# Altium project Pet_Feeder_Board.PrjPcb (part 2 of 3)

## Sheet BG_PWR_Radio_Schematic.SchDoc
size A; SheetNumber: 3; SheetTotal: 6
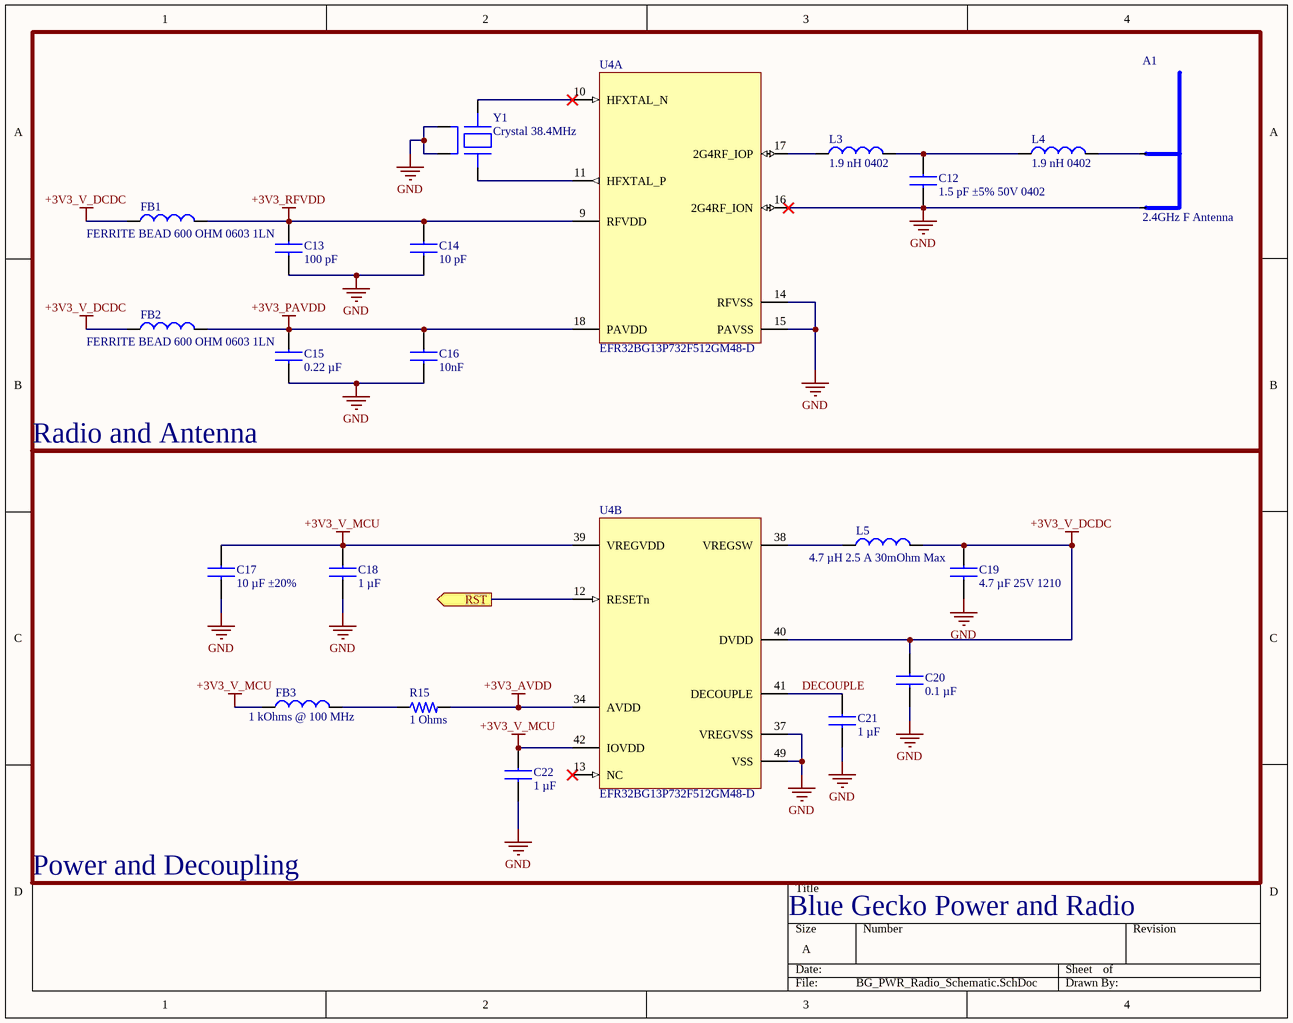
[diagram p2: BG_PWR_Radio_Schematic.SchDoc]

### Parts
A1  2.4GHz F Antenna  [F_ANT]  (net tie, no BOM)
C12  1.5 pF ±5% 50V 0402  [CAPC0402X06N]
C13  100 pF  [CAPC0603X09N]
C14  10 pF  [CAPC0603X09N]
C15  0.22 µF  [CAPC0603X10N-Y]
C16  10nF  [CAPC0603X09N]
C17  10 µF ±20%  [CAPC0603X10N-M]
C18  1 µF  [CAPC0603X10N]
C19  4.7 µF 25V 1210  [CAPC1210X17N]
C20  0.1 µF  [CAPC0603X09N]
C21  1 µF  [CAPC0603X10N]
C22  1 µF  [CAPC0603X10N]
FB1  FERRITE BEAD 600 OHM 0603 1LN  [BLM18AG601SN1D]
FB2  FERRITE BEAD 600 OHM 0603 1LN  [BLM18AG601SN1D]
FB3  1 kOhms @ 100 MHz  [INDC0603X10N]
L3  1.9 nH 0402  [INDC0402X04N]
L4  1.9 nH 0402  [INDC0402X04N]
L5  4.7 µH 2.5 A 30mOhm Max  [INDP7272X45N]
R15  1 Ohms  [RESC0603X05N]
U4  EFR32BG13P732F512GM48-D  [48-QFN_7x7]  (parts A,B of 3)
Y1  Crystal 38.4MHz  [DFN105P160X40-4N]

### Blocks framed on the sheet
Radio and Antenna: A1 C12-C16 FB1 FB2 L3 L4 U4 Y1
Power and Decoupling: C17-C22 FB3 L5 R15 U4

### Ports
RST (out)

### Nets
+3V3_AVDD: R15.2 U4.34(AVDD)
+3V3_PAVDD: C15.1 C16.1 FB2.2 U4.18(PAVDD)
+3V3_RFVDD: C13.1 C14.1 FB1.2 U4.9(RFVDD)
+3V3_V_DCDC: C19.1 C20.1 FB1.1 FB2.1 L5.2 U4.40(DVDD)
+3V3_V_MCU: C17.1 C18.1 C22.1 FB3.1 U4.39(VREGVDD) U4.42(IOVDD)
GND: A1.GND C12.2 C13.2 C14.2 C15.2 C16.2 C17.2 C18.2 C19.2 C20.2 C21.2 C22.2 U4.14(RFVSS) U4.15(PAVSS) U4.16(2G4RF_ION) U4.37(VREGVSS) U4.49(VSS) Y1.2(GND) Y1.4(GND)
DECOUPLE: C21.1 U4.41(DECOUPLE)
RST: U4.12(RESETn) ; port RST
NetA1_FEED: A1.FEED L4.2
NetC12_1: C12.1 L3.2 L4.1
NetFB3_2: FB3.2 R15.1
NetL3_1: L3.1 U4.17(2G4RF_IOP)
NetL5_1: L5.1 U4.38(VREGSW)
NetU4_10: U4.10(HFXTAL_N) Y1.1(OSC_1)
NetU4_11: U4.11(HFXTAL_P) Y1.3(OSC_2)

Not connected (* = marked no-connect by the designer): U4 13(NC)*

### Notes on the sheet
- Blue Gecko Power and Radio

### Library data of the parts
A1 = F_ANT
C12 = GCM1555C1H1R5JA16D: Cap Ceramic 1.5pF 50V C0G 5% Pad SMD 0402 125C Automotive T/R; Manufacturer: Murata; Supplier 1: Digi-Key; Manufacturer Part Number: GCM1555C1H1R5JA16D; RoHS: Yes; Category: Ceramic Capacitors; Stock 1: 4046; Pricing 1: 1=0.10000, 10=0.04700, 50=0.02580, 100=0.02100, 500=0.01502, 1000=0.01180, 2500=0.01072, 5000=0.00987 (USD); Mount: Surface Mount; Case/Package: 0402; Case Code (Imperial): 0402; Case Code (Metric): 1005; Min Operating Temperature: -55°C; Max Operating Temperature: 125°C; Packaging: Cut Tape; Capacitance: 1.5pF; Tolerance: 5%; Voltage Rating: 50V; Ratings: AEC-Q200; ComponentLink1URL: http://search.murata.co.jp/Ceramy/image/img/A01X/G101/ENG/GCM1555C1H1R5JA16-01.pdf?src-supplier=Digi-Key; ComponentLink1Description: http://search.murata.co.jp/Ceramy/image/img/A01X/G101/ENG/GCM1555C1H1R5JA16-01.pdf?src-supplier=Digi-Key
C13 = C0603C101J4GAC7867: Cap Ceramic 100pF 16V C0G 5% SMD 0603 125°C Paper T/R; Manufacturer: KEMET; Supplier 1: Digi-Key; Manufacturer Part Number: C0603C101J4GAC7867; RoHS: Yes; Category: Ceramic Capacitors; Stock 1: 12069; Pricing 1: 1=0.25000, 10=0.17400, 50=0.11580, 100=0.09840, 500=0.06944, 1000=0.06075 (USD); Mount: Surface Mount; Case/Package: 0603; Dielectric Material: Ceramic; Min Operating Temperature: -55°C; Max Operating Temperature: 125°C; Capacitance: 100pF; Tolerance: 5%; Dielectric: C0G; Packaging: Tape and Reel; Voltage Rating (DC): 16V; Construction: Flat; Length: 1.6mm; Height: 0.8mm; Depth: 0.8mm; Radiation Hardening: No; Lead Free: Lead Free; ComponentLink1URL: http://components.arrow.com/part/dataview/0323_00312687?src-supplier=Arrow+Europe; ComponentLink1Description: http://components.arrow.com/part/dataview/0323_00312687?src-supplier=Arrow+Europe; ComponentLink2URL: http://capacitoredge.kemet.com/capedge2/DataSheet?pn=C0603C101J4GAC7867&src-supplier=Avnet+Europe; ComponentLink2Description: http://capacitoredge.kemet.com/capedge2/DataSheet?pn=C0603C101J4GAC7867&src-supplier=Avnet+Europe; ComponentLink3URL: https://api.kemet.com/component-edge/download/datasheet/C0603C101J4GACTU.pdf?src-supplier=Digi-Key; ComponentLink3Description: https://api.kemet.com/component-edge/download/datasheet/C0603C101J4GACTU.pdf?src-supplier=Digi-Key; ComponentLink4URL: https://search.kemet.com/component-edge/download/datasheet/C0603C101J4GACTU.pdf?src-supplier=Digi-Key; ComponentLink4Description: https://search.kemet.com/component-edge/download/datasheet/C0603C101J4GACTU.pdf?src-supplier=Digi-Key; ComponentLink5URL: http://capacitoredge.kemet.com/capedge2/DataSheet?pn=C0603C101J4GAC7867&src-supplier=Avnet; ComponentLink5Description: http://capacitoredge.kemet.com/capedge2/DataSheet?pn=C0603C101J4GAC7867&src-supplier=Avnet
C14 = C0603C100J4GAC7867: Cap Ceramic 10pF 16V C0G 5% SMD 0603 125°C Paper T/R; Manufacturer: KEMET; Supplier 1: Digi-Key; Manufacturer Part Number: C0603C100J4GAC7867; RoHS: Yes; Category: Ceramic Capacitors; Stock 1: 29408; Pricing 1: 1=0.25000, 10=0.17400, 50=0.11580, 100=0.09840, 500=0.06944, 1000=0.06075 (USD); Mount: Surface Mount; Case/Package: 0603; Dielectric Material: Ceramic; Min Operating Temperature: -55°C; Max Operating Temperature: 125°C; Capacitance: 10pF; Tolerance: 5%; Dielectric: C0G; Packaging: Tape and Reel; Voltage Rating (DC): 16V; Construction: Flat; Length: 1.6mm; Height: 0.8mm; Depth: 0.8mm; Radiation Hardening: No; Lead Free: Lead Free; ComponentLink1URL: http://components.arrow.com/part/dataview/0323_00312750?src-supplier=Arrow+Europe; ComponentLink1Description: http://components.arrow.com/part/dataview/0323_00312750?src-supplier=Arrow+Europe; ComponentLink2URL: http://capacitoredge.kemet.com/capedge2/DataSheet?pn=C0603C100J4GAC7867&src-supplier=Avnet+Europe; ComponentLink2Description: http://capacitoredge.kemet.com/capedge2/DataSheet?pn=C0603C100J4GAC7867&src-supplier=Avnet+Europe; ComponentLink3URL: https://api.kemet.com/component-edge/download/datasheet/C0603C100J4GACTU.pdf?src-supplier=Digi-Key; ComponentLink3Description: https://api.kemet.com/component-edge/download/datasheet/C0603C100J4GACTU.pdf?src-supplier=Digi-Key; ComponentLink4URL: http://capacitoredge.kemet.com/capedge2/DataSheet?pn=C0603C100J4GAC7867&src-supplier=Avnet; ComponentLink4Description: http://capacitoredge.kemet.com/capedge2/DataSheet?pn=C0603C100J4GAC7867&src-supplier=Avnet
C15 = CC0603JRX7R7BB224: 0603 0.22 uF 16 V ±5% Tolerance X7R Multilayer Ceramic Capacitor; Manufacturer: Yageo; Capacitance: 220nF; Voltage Rating (DC): 16V; Supplier 1: Digi-Key; Manufacturer Part Number: CC0603JRX7R7BB224; RoHS: Yes; Category: Ceramic Capacitors; Stock 1: 48553; Pricing 1: 1=0.14000, 10=0.09800, 50=0.05580, 100=0.04620, 500=0.03238, 1000=0.02680 (USD); Mount: Surface Mount; Case/Package: 0603; Case Code (Imperial): 0603; Case Code (Metric): 1608; Weight: 7.1E-05oz; Min Operating Temperature: -55°C; Max Operating Temperature: 125°C; Tolerance: 5%; Packaging: Tape and Reel; Dielectric: X7R; Voltage Rating: 16V; Termination: SMD/SMT; Resistor Type: Ceramic; Series: CC; Length: 0.063inch; Width: 0.031inch; Thickness: 0.035inch; Depth: 0.8mm; Lead Free: Lead Free; Halogen Free: Halogen Free; RoHS Compliant: Yes; ComponentLink1URL: http://www.mouser.com/ds/2/447/Yageo_UPY-GP_NP0_16V-to-50V_9-358835.pdf?src-supplier=Mouser; ComponentLink1Description: http://www.mouser.com/ds/2/447/Yageo_UPY-GP_NP0_16V-to-50V_9-358835.pdf?src-supplier=Mouser; ComponentLink2URL: http://components.arrow.com/part/dataview/0323_04166475?src-supplier=Arrow+Europe; ComponentLink2Description: http://components.arrow.com/part/dataview/0323_04166475?src-supplier=Arrow+Europe; ComponentLink3URL: http://www.yageo.com/exep/pages/download/literatures/ProductSelectionGuide%202014_Final_2.pdf?src-supplier=Digi-Key; ComponentLink3Description: http://www.yageo.com/exep/pages/download/literatures/ProductSelectionGuide%202014_Final_2.pdf?src-supplier=Digi-Key; ComponentLink4URL: http://www.yageo.com/documents/recent/UPY-GPHC_X7R_6.3V-to-50V_18.pdf?src-supplier=Digi-Key; ComponentLink4Description: http://www.yageo.com/documents/recent/UPY-GPHC_X7R_6.3V-to-50V_18.pdf?src-supplier=Digi-Key
C16 = C0603C103J4RACTU: Cap Ceramic 0.01uF 16V X7R 5% SMD 0603 125°C Paper T/R; Manufacturer: KEMET; Dissipation Factor: 3.5%; Supplier 1: Digi-Key; Manufacturer Part Number: C0603C103J4RACTU; RoHS: Yes; Category: Ceramic Capacitors; Stock 1: 5301; Pricing 1: 1=0.35000, 10=0.24300, 50=0.16200, 100=0.13760, 500=0.09716, 1000=0.08501 (USD); Mount: Surface Mount; Case/Package: 0603; Case Code (Metric): 1608; Case Code (Imperial): 0603; Dielectric Material: Ceramic; Min Operating Temperature: -55°C; Max Operating Temperature: 125°C; Tolerance: 5%; Capacitance: 10nF; Dielectric: X7R; Packaging: Tape and Reel; Voltage Rating: 16V; Package Quantity: 1; Voltage Rating (DC): 16V; Termination: SMD/SMT; Series: C; Construction: Flat; Length: 1.6mm; Width: 0.031inch; Height: 0.8mm; Thickness: 0.034inch; Lead Pitch: 0.7mm; Depth: 0.8mm; Radiation Hardening: No; REACH SVHC: No SVHC; RoHS Compliant: Yes; ComponentLink1URL: https://datasheet.ciiva.com/5417/kem-c1002-x7r-smd-5417414.pdf?src-supplier=Mouser; ComponentLink1Description: https://datasheet.ciiva.com/5417/kem-c1002-x7r-smd-5417414.pdf?src-supplier=Mouser
C17 = GRT188C81C106ME13D: 0603 10 uF 16 V ±20% Tolerance X6S Surface Mount Multilayer Ceramic Capacitor; Manufacturer: Murata; Capacitance: 10uF; Voltage Rating: 16V; Supplier 1: Digi-Key; Manufacturer Part Number: GRT188C81C106ME13D; RoHS: No; Category: Ceramic Capacitors; Stock 1: 8428; Pricing 1: 1=0.50000, 10=0.34800, 50=0.24380, 100=0.20890, 500=0.15666, 1000=0.13230 (USD); Mount: Surface Mount; Case/Package: 0603; Case Code (Metric): 1608; Case Code (Imperial): 0603; Min Operating Temperature: -55°C; Max Operating Temperature: 105°C; Packaging: Tape and Reel; Tolerance: 20%; Length: 0.063inch; Width: 0.031inch; Thickness: 0.035inch; Ratings: AEC-Q200; RoHS Compliant: No; ComponentLink1URL: http://search.murata.co.jp/Ceramy/image/img/A01X/G101/ENG/GRT188C81C106ME13-01.pdf?src-supplier=Digi-Key; ComponentLink1Description: http://search.murata.co.jp/Ceramy/image/img/A01X/G101/ENG/GRT188C81C106ME13-01.pdf?src-supplier=Digi-Key
C18 C21 C22 = C0603X105J4RAC7867: Cap Ceramic 1uF 16V X7R 5% SMD 0603 125°C Paper T/R; Manufacturer: KEMET; Supplier 1: Digi-Key; Manufacturer Part Number: C0603X105J4RAC7867; RoHS: No; Category: Ceramic Capacitors; Stock 1: 20000; Pricing 1: 1=0.46000, 10=0.32200, 50=0.24340, 100=0.21210, 500=0.15708, 1000=0.13352 (USD); Mount: Surface Mount; Case/Package: 0603; Case Code (Imperial): 0603; Case Code (Metric): 1608; Min Operating Temperature: -55°C; Max Operating Temperature: 125°C; Features: Soft Termination; Packaging: Tape and Reel; Capacitance: 1uF; Tolerance: 5%; Voltage Rating: 16V; ComponentLink1URL: https://api.kemet.com/component-edge/download/datasheet/C0603X105J4RAC7867.pdf?src-supplier=Digi-Key; ComponentLink1Description: https://api.kemet.com/component-edge/download/datasheet/C0603X105J4RAC7867.pdf?src-supplier=Digi-Key
C19 = C1210C475J3NACTU: 1210 C 4.7uF Ceramic Multilayer Capacitor; 25 VDC; +85degC; X8L Dielec; +/-5%; Manufacturer: KEMET; Tolerance: 5%; Dissipation Factor: 10%; Supplier 1: Digi-Key; Manufacturer Part Number: C1210C475J3NACTU; RoHS: Yes; Category: Ceramic Capacitors; Stock 1: 7987; Pricing 1: 1=1.07000, 10=0.81000, 50=0.67300, 100=0.57950, 500=0.44866 (USD); Mount: Surface Mount,PCB; Case/Package: 1210; Case Code (Imperial): 1210; Case Code (Metric): 3225; Dielectric Material: Ceramic; Min Operating Temperature: -55°C; Max Operating Temperature: 150°C; Capacitance: 4.7uF; Dielectric: X8L; Voltage Rating: 25V; Voltage Rating (DC): 25V; Packaging: Tape and Reel; Package Quantity: 1; Termination: SMD/SMT; Voltage: 25V; Features: High Temperature; Series: C; Construction: Flat; Length: 3.2mm; Width: 2.5mm; Height: 2.5mm; Thickness: 0.11inch; Depth: 2.5mm; Radiation Hardening: No; REACH SVHC: No SVHC; Lead Free: Lead Free; RoHS Compliant: Yes; ComponentLink1URL: https://datasheet.ciiva.com/158/kem-c1008-x8l-150c-smd-158325.pdf?src-supplier=Digi-Key; ComponentLink1Description: https://datasheet.ciiva.com/158/kem-c1008-x8l-150c-smd-158325.pdf?src-supplier=Digi-Key; ComponentLink2URL: https://datasheet.ciiva.com/158/kem-c1008-x8l-150c-smd-158326.pdf?src-supplier=Digi-Key; ComponentLink2Description: https://datasheet.ciiva.com/158/kem-c1008-x8l-150c-smd-158326.pdf?src-supplier=Digi-Key; ComponentLink3URL: https://datasheet.ciiva.com/158/kem-c1008-x8l-150c-smd-158327.pdf?src-supplier=Digi-Key; ComponentLink3Description: https://datasheet.ciiva.com/158/kem-c1008-x8l-150c-smd-158327.pdf?src-supplier=Digi-Key
C20 = C0603C104J4REC7867: Cap Cer 0603 0.1UF 16V X7R 5%; Manufacturer: KEMET; Supplier 1: Digi-Key; Manufacturer Part Number: C0603C104J4REC7867; RoHS: No; Category: Ceramic Capacitors; Stock 1: 12000; Pricing 1: 1=0.16000, 10=0.11300, 50=0.06420, 100=0.05310, 500=0.03724, 1000=0.03083 (USD)
FB1 FB2 = BLM18AG601SN1D: Ferrite Beads Multi-Layer 600Ohm 25% 100MHz 500mA 380mOhm DCR 0603 Automotive Paper T/R; Manufacturer: Murata; Material: Steel,Ferrite; Impedance: 600R; DC Resistance (DCR): 380mR; Shielding: Unshielded; Number of Circuits: 1; Supplier 1: Digi-Key; Manufacturer Part Number: BLM18AG601SN1D; RoHS: Yes; Category: Inductors; Pricing 1: 1=0.10000, 10=0.07900, 25=0.07200, 50=0.06480, 100=0.04760, 250=0.03460, 500=0.03170, 1000=0.02738 (USD); Case/Package: 0603; Number of Pins: 2; Core Material: Ferrite; Case Code (Metric): 1608; Case Code (Imperial): 0603; Weight: 7.1E-05oz; Min Operating Temperature: -55°C; Max Operating Temperature: 125°C; Tolerance: 25%; Package Quantity: 1; Packaging: Tape and Reel; Current Rating: 500mA; Termination: SMD/SMT; Max DC Current: 500mA; Max Current Rating: 500mA; Number of Lines: 1; Test Frequency: 100MHz; DC Current: 500mA; Frequency: 100MHz; Length: 1.6mm; Width: 0.8mm; Height: 0.8mm; Depth: 0.8mm; Radiation Hardening: No; RoHS Compliant: Yes; REACH SVHC: No SVHC; Military Standard: Not; Lead Free: Lead Free; ComponentLink1URL: https://datasheet.ciiva.com/19460/1844766-19460213.pdf?src-supplier=Jameco; ComponentLink1Description: https://datasheet.ciiva.com/19460/1844766-19460213.pdf?src-supplier=Jameco; ComponentLink2URL: https://datasheet.ciiva.com/41449/001172228-da-01-en-drossel-0603-600r-1-6x0-8mm-4000st-41449517.pdf?src-supplier=Conrad; ComponentLink2Description: https://datasheet.ciiva.com/41449/001172228-da-01-en-drossel-0603-600r-1-6x0-8mm-4000st-41449517.pdf?src-supplier=Conrad; ComponentLink3URL: https://datasheet.ciiva.com/29347/442309-da-01-en-chip-drossel-0603-600r-500ma-1-6x0-8mm-29347900.pdf?src-supplier=Conrad; ComponentLink3Description: https://datasheet.ciiva.com/29347/442309-da-01-en-chip-drossel-0603-600r-500ma-1-6x0-8mm-29347900.pdf?src-supplier=Conrad; ComponentLink4URL: https://datasheet.ciiva.com/1466/1756147-1466934.pdf?src-supplier=Element14; ComponentLink4Description: https://datasheet.ciiva.com/1466/1756147-1466934.pdf?src-supplier=Element14; ComponentLink5URL: https://datasheet.ciiva.com/1466/1756147-1466933.pdf?src-supplier=Element14; ComponentLink5Description: https://datasheet.ciiva.com/1466/1756147-1466933.pdf?src-supplier=Element14; ComponentLink6URL: https://datasheet.ciiva.com/1012/l0110s0100blm18a-1012018.pdf?src-supplier=Digi-Key; ComponentLink6Description: https://datasheet.ciiva.com/1012/l0110s0100blm18a-1012018.pdf?src-supplier=Digi-Key; ComponentLink7URL: https://datasheet.ciiva.com/1012/l0110s0100blm18a-1012017.pdf?src-supplier=Digi-Key; ComponentLink7Description: https://datasheet.ciiva.com/1012/l0110s0100blm18a-1012017.pdf?src-supplier=Digi-Key; ComponentLink8URL: https://datasheet.ciiva.com/1012/l0110s0100blm18a-1012019.pdf?src-supplier=Digi-Key; ComponentLink8Description: https://datasheet.ciiva.com/1012/l0110s0100blm18a-1012019.pdf?src-supplier=Digi-Key; ComponentLink9URL: https://datasheet.ciiva.com/16210/l0110s0100blm18a-16210006.pdf?src-supplier=Future+Electronics; ComponentLink9Description: https://datasheet.ciiva.com/16210/l0110s0100blm18a-16210006.pdf?src-supplier=Future+Electronics; ComponentLink10URL: https://datasheet.ciiva.com/3081/l0110s0100blm18a-3081613.pdf?src-supplier=Avnet; ComponentLink10Description: https://datasheet.ciiva.com/3081/l0110s0100blm18a-3081613.pdf?src-supplier=Avnet
FB3 = 74279266: Ferrite Beads Multi-Layer 1KOhm 25% 100MHz 0.65A 0.6Ohm DCR 0603 T/R; Manufacturer: Wurth Electronics; Impedance: 1kR; Max DC Current: 200mA; DC Resistance (DCR): 600mR; Number of Lines: 1; Inductance: 1.8nH; Shielding: Unshielded; Supplier 1: Digi-Key; Manufacturer Part Number: 74279266; RoHS: Yes; Category: Ferrite Beads and Chips; Pricing 1: 1=0.18000, 50=0.17400, 100=0.16000, 500=0.15300, 1000=0.14600, 2000=0.13900 (USD); Case/Package: SMD/SMT; Case Code (Metric): 1608; Case Code (Imperial): 0603; Core Material: Ferrite; Min Operating Temperature: -55°C; Max Operating Temperature: 125°C; Tolerance: 25%; Packaging: Tape and Reel; Termination: SMD/SMT; Test Frequency: 100MHz; Max Current Rating: 200mA; Series: WE-CBF; Current Rating: 200mA; Length: 1.6mm; Width: 0.8mm; Height: 0.8mm; Depth: 0.8mm; Lead Free: Lead Free; REACH SVHC: Unknown; RoHS Compliant: Yes; ComponentLink1URL: https://datasheet.ciiva.com/12395/74279266-221135-12395453.pdf?src-supplier=Mouser; ComponentLink1Description: https://datasheet.ciiva.com/12395/74279266-221135-12395453.pdf?src-supplier=Mouser; ComponentLink2URL: https://datasheet.ciiva.com/14971/74279266-14971192.pdf?src-supplier=Digi-Key; ComponentLink2Description: https://datasheet.ciiva.com/14971/74279266-14971192.pdf?src-supplier=Digi-Key; ComponentLink3URL: https://datasheet.ciiva.com/14634/0900766b801ef1d0-14634816.pdf?src-supplier=Allied+Electronics; ComponentLink3Description: https://datasheet.ciiva.com/14634/0900766b801ef1d0-14634816.pdf?src-supplier=Allied+Electronics; ComponentLink4URL: https://datasheet.ciiva.com/11799/0900766b801ef1d0-11799352.pdf?src-supplier=RSComponents; ComponentLink4Description: https://datasheet.ciiva.com/11799/0900766b801ef1d0-11799352.pdf?src-supplier=RSComponents; ComponentLink5URL: https://datasheet.ciiva.com/23763/74279266-23763009.pdf?src-supplier=Newark; ComponentLink5Description: https://datasheet.ciiva.com/23763/74279266-23763009.pdf?src-supplier=Newark; ComponentLink6URL: https://datasheet.ciiva.com/22711/1705901-22711422.pdf?src-supplier=Element14; ComponentLink6Description: https://datasheet.ciiva.com/22711/1705901-22711422.pdf?src-supplier=Element14; ComponentLink7URL: https://datasheet.ciiva.com/1466/1705901-1466509.pdf?src-supplier=Element14; ComponentLink7Description: https://datasheet.ciiva.com/1466/1705901-1466509.pdf?src-supplier=Element14; ComponentLink8URL: https://datasheet.ciiva.com/48698/001087059-da-01-ml-we-cbf-smd-ferrit-74279266-de-en-48698427.pdf?src-supplier=Conrad; ComponentLink8Description: https://datasheet.ciiva.com/48698/001087059-da-01-ml-we-cbf-smd-ferrit-74279266-de-en-48698427.pdf?src-supplier=Conrad
L3 L4 = 36401E1N9ATDF: Ind High Frequency Chip Molded/Unshielded Thin Film 1.9nH 0.2nH 500MHz 13Q-Factor 560mA 0402 T/R; Manufacturer: TE Connectivity; Q Factor: 13; Tolerance: 0.2%; Inductance: 0.0019uH; DC Resistance (DCR): 350mR; Self Resonant Frequency: 8GHz; Lead/Base Style: SMD/SMT; Supplier 1: Digi-Key; Manufacturer Part Number: 36401E1N9ATDF; RoHS: Yes; Category: Fixed Inductors; Stock 1: 735; Pricing 1: 1=0.21000, 10=0.19200, 25=0.17080, 50=0.14520, 100=0.12820, 250=0.11752, 500=0.10684 (USD); Mount: Surface Mount; Case/Package: 0402; Number of Pins: 2; Case Code (Metric): 1005; Case Code (Imperial): 0402; Weight: 2.3E-05oz; Min Operating Temperature: -40°C; Max Operating Temperature: 85°C; Packaging: Tape and Reel; Package Quantity: 1000; Max DC Current: 560mA; Termination: SMD/SMT; Test Frequency: 500MHz; Max Frequency: 500MHz; Shielding: Unshielded; Resistor Type: Thin Film; Max Current Rating: 560mA; Series: 3640; Technology: THIN FILM; Length: 1mm; Width: 0.5mm; Height: 0.32mm; Depth: 0.55mm; Radiation Hardening: No; REACH SVHC: Unknown; ELV: Compliant; RoHS Compliant: Yes; ComponentLink1URL: https://datasheet.ciiva.com/1131/eng-cd-1624108-ba-1131568.pdf?src-supplier=Farnell; ComponentLink1Description: https://datasheet.ciiva.com/1131/eng-cd-1624108-ba-1131568.pdf?src-supplier=Farnell; ComponentLink2URL: https://datasheet.ciiva.com/11800/0900766b80e1823e-11800596.pdf?src-supplier=RSComponents; ComponentLink2Description: https://datasheet.ciiva.com/11800/0900766b80e1823e-11800596.pdf?src-supplier=RSComponents; ComponentLink3URL: https://datasheet.ciiva.com/1129/1610600-1129220.pdf?src-supplier=Element14; ComponentLink3Description: https://datasheet.ciiva.com/1129/1610600-1129220.pdf?src-supplier=Element14; ComponentLink4URL: https://datasheet.ciiva.com/1129/1610600-1129221.pdf?src-supplier=Element14; ComponentLink4Description: https://datasheet.ciiva.com/1129/1610600-1129221.pdf?src-supplier=Element14
L5 = B82472G6472M000: Ind Power Shielded 4.7uH 20% 100KHz Ferrite 2.5A Blister T/R; Manufacturer: TDK EPCOS; Max DC Current: 2A; DC Resistance (DCR): 30mR; Supplier 1: Digi-Key; Manufacturer Part Number: B82472G6472M000; RoHS: Yes; Category: Fixed Inductors; Stock 1: 890; Pricing 1: 1=1.55000, 10=1.43500, 25=1.32480, 50=1.10420, 100=1.03790, 250=0.92748, 500=0.79496 (USD); Mount: Surface Mount; Case/Package: SMD/SMT; Number of Pins: 2; Core Material: Ferrite; Weight: 0.052911oz; Inductance Tolerance: 20%; Shielding: Shielded; Tolerance: 20%; Packaging: Tape and Reel; Package Quantity: 1000; Inductance: 4.7uH; Termination: SMD/SMT; RMS Current (Irms): 2.5A; Saturation Current: 2A; Test Frequency: 100kHz; DC Current: 2.5A; Series: B82472G6; Inductor Type: POWER; Length: 7.3mm; Width: 7.3mm; Height: 4.5mm; Depth: 7.5mm; REACH SVHC: No SVHC; Military Standard: Not; ComponentLink1URL: https://datasheet.ciiva.com/5874/78362-5874896.pdf?src-supplier=Farnell; ComponentLink1Description: https://datasheet.ciiva.com/5874/78362-5874896.pdf?src-supplier=Farnell; ComponentLink2URL: https://datasheet.ciiva.com/8003/78362-8003419.pdf?src-supplier=Element14; ComponentLink2Description: https://datasheet.ciiva.com/8003/78362-8003419.pdf?src-supplier=Element14; ComponentLink3URL: https://datasheet.ciiva.com/22700/1899161-22700808.pdf?src-supplier=Element14; ComponentLink3Description: https://datasheet.ciiva.com/22700/1899161-22700808.pdf?src-supplier=Element14
R15 = CRCW06031R00FNEB: Thick Film Resistors - SMD 1/10watt 1ohms 1% 200ppm; Manufacturer: Vishay Dale; Resistance: 1R; Power Rating: 100mW; Voltage Rating: 75V; Temperature Coefficient: 200ppm/°C; Supplier 1: Digi-Key; Manufacturer Part Number: CRCW06031R00FNEB; RoHS: Yes; Category: Chip SMD Resistors; Stock 1: 18550; Pricing 1: 1=0.10000, 10=0.07700, 100=0.03120, 1000=0.01402, 2500=0.01217, 5000=0.01005 (USD); Case/Package: 0603; Weight: 7.1E-05oz; Case Code (Imperial): 0603; Case Code (Metric): 1608; Contact Plating: Tin; Min Operating Temperature: -55°C; Max Operating Temperature: 155°C; Tolerance: 1%; Packaging: Tape and Reel; Package Quantity: 10000; Resistor Type: Thick Film; Number of Terminations: 2; Termination: SMD/SMT; Max Power Dissipation: 100mW; Features: Automotive AEC-Q200; Series: CRCW; Length: 0.061inch; Width: 0.033inch; Height: 0.02inch; Radiation Hardening: No; Lead Free: Lead Free; RoHS Compliant: Yes; ComponentLink1URL: https://datasheet.ciiva.com/5549/dcrcwe3-109170-5549015.pdf?src-supplier=Mouser; ComponentLink1Description: https://datasheet.ciiva.com/5549/dcrcwe3-109170-5549015.pdf?src-supplier=Mouser
U4 = EFR32BG13P732F512GM48-D: Blue Gecko QFN48 2.4 G 19 dB BLE/Proprietary 512 kB 64 kB(RAM) 31GPIO; Manufacturer: Silicon Labs; Supplier 1: Digi-Key; RoHS: Yes; Category: RF Receivers, Transceivers; Pricing 1: 1=8.42000, 10=7.72000, 25=7.01800, 80=6.31625, 230=5.78987, 440=5.26350, 945=4.78499 (USD); ComponentLink1URL: http://www.farnell.com/datasheets/2813683.pdf?src-supplier=Farnell; ComponentLink1Description: http://www.farnell.com/datasheets/2813683.pdf?src-supplier=Farnell; Supplier Part Number 1: 336-5922-ND; Manufacturer Part Number: EFR32BG13P732F512GM48-D
Y1 = 8Q-38.400MAAC-T: Crystal 38.4MHz ±30ppm (Tol) ±30ppm (Stability) 9pF FUND 80Ohm 4-Pin SMD T/R; Manufacturer: TXC; Supplier 1: Digi-Key; Manufacturer Part Number: 8Q-38.400MAAC-T; RoHS: No; Category: Uncategorized; Stock 1: 3000; Pricing 1: 1=0.79000, 10=0.69700, 50=0.65140, 100=0.57570, 500=0.54540, 1000=0.45450 (USD)

## Sheet Peripheral_Schematic.SchDoc
size A; SheetNumber: 4; SheetTotal: 6
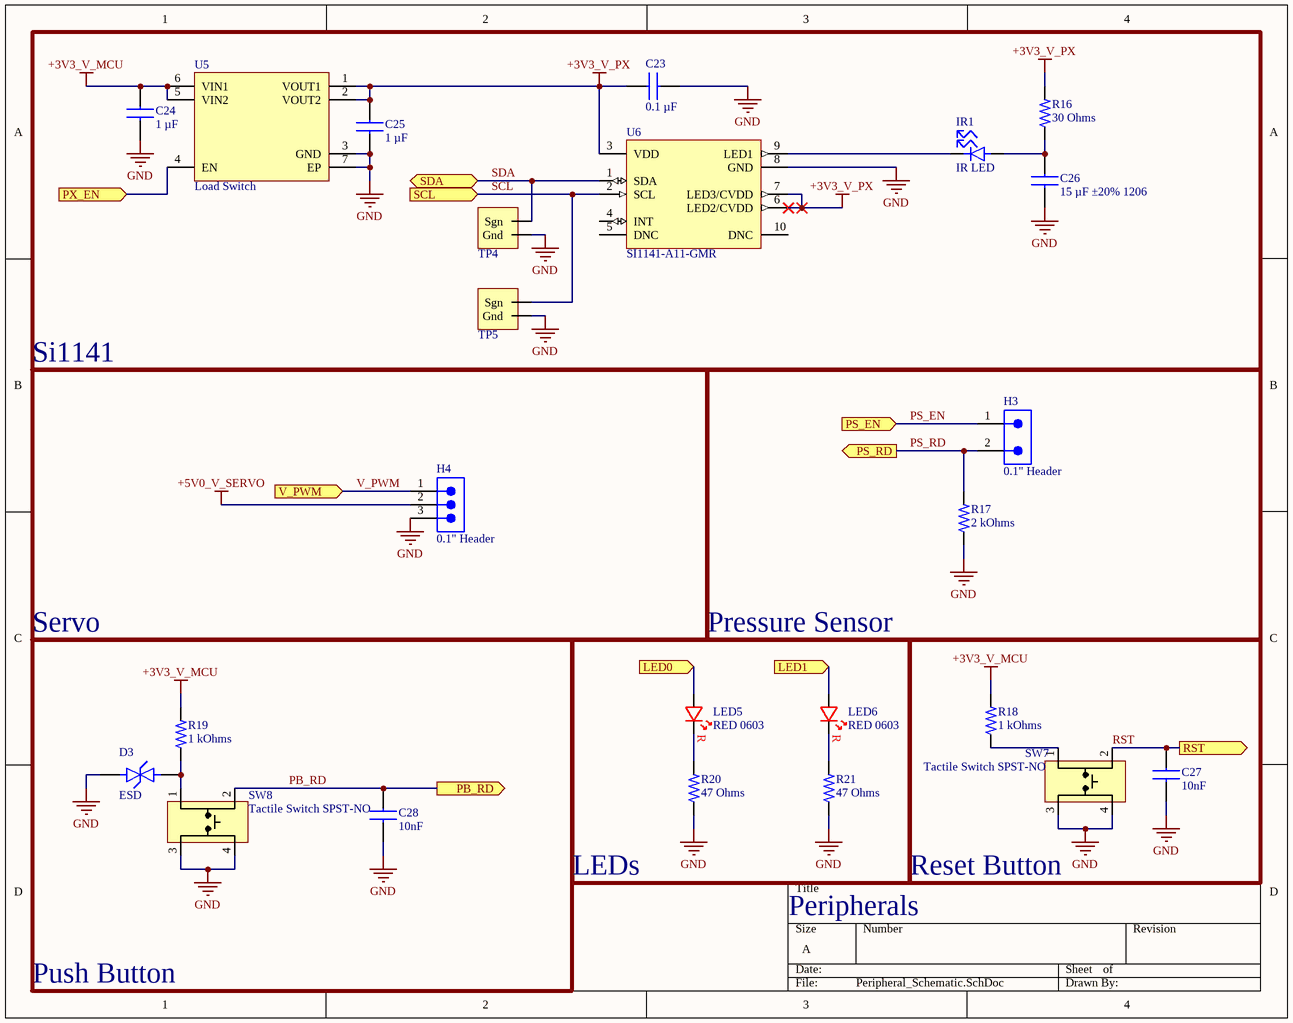
[diagram p3: Peripheral_Schematic.SchDoc]

### Parts
C23  0.1 µF  [CAPC0603X09N]
C24  1 µF  [CAPC0603X10N]
C25  1 µF  [CAPC0603X10N]
C26  15 µF ±20% 1206  [CAP_1206_TDK-M]
C27  10nF  [CAPC0603X09N]
C28  10nF  [CAPC0603X09N]
D3  ESD  [DFN65P100X26-2N]
H3  0.1" Header  [2_PIN_100MIL]
H4  0.1" Header  [3-PIN_MALE_HEADER_01-IN - duplicate]
IR1  IR LED  [LED_THROUGH-HOLE]
LED5  RED 0603  [DIOC0603X06N]
LED6  RED 0603  [DIOC0603X06N]
R16  30 Ohms  [RESC0603X05N-2]
R17  2 kOhms  [RESC0603X05N-1]
R18  1 kOhms  [RESC0603X05N-2]
R19  1 kOhms  [RESC0603X05N-2]
R20  47 Ohms  [RESC0603X06N]
R21  47 Ohms  [RESC0603X06N]
SW7  Tactile Switch SPST-NO  [Switch]
SW8  Tactile Switch SPST-NO  [Switch]
TP4  10x Probe TP  [TP10x_Probe]  (value not drawn)  (no BOM)
TP5  10x Probe TP  [TP10x_Probe]  (value not drawn)  (no BOM)
U5  Load Switch  [SON65P200X60_HS-7N]
U6  SI1141-A11-GMR  [QFN10_2X2_SIL]

### Blocks framed on the sheet
Si1141: C23-C26 IR1 R16 TP4 TP5 U5 U6
Pressure Sensor: H3 R17
Reset Button: C27 R18 SW7

### Ports
LED0 (in), LED1 (in), PB_RD (out), PS_EN (in), PS_RD (out), PX_EN (in), RST (out), SCL (in), SDA (bidir), V_PWM (in)

### Nets
+3V3_V_MCU: C24.1 R18.2 R19.2 U5.5(VIN2) U5.6(VIN1)
+3V3_V_PX: C23.2 C25.1 R16.2 U5.1(VOUT1) U5.2(VOUT2) U6.3(VDD) U6.6(LED2/CVDD) U6.7(LED3/CVDD)
+5V0_V_SERVO: H4.2
GND: C23.1 C24.2 C25.2 C26.2 C27.2 C28.2 D3.1 H4.3 R17.1 R20.1 R21.1 SW7.3 SW7.4 SW8.3 SW8.4 TP4.2(Gnd) TP5.2(Gnd) U5.3(GND) U5.7(EP) U6.8(GND)
LED0: LED5.A ; port LED0
LED1: LED6.A ; port LED1
PB_RD: C28.1 SW8.2 ; port PB_RD
PS_EN: H3.1 ; port PS_EN
PS_RD: H3.2 R17.2 ; port PS_RD
PX_EN: U5.4(EN) ; port PX_EN
RST: C27.1 SW7.2 ; port RST
SCL: TP5.1(Sgn) U6.2(SCL) ; port SCL
SDA: TP4.1(Sgn) U6.1(SDA) ; port SDA
V_PWM: H4.1 ; port V_PWM
NetC26_1: C26.1 IR1.1 R16.1
NetD3_2: D3.2 R19.1 SW8.1
NetIR1_2: IR1.2 U6.9(LED1)
NetLED5_C: LED5.C R20.2
NetLED6_C: LED6.C R21.2
NetR18_1: R18.1 SW7.1

Not connected (* = marked no-connect by the designer): U6 4(INT) 5(DNC) 10(DNC)

### Notes on the sheet
- Servo
- LEDs
- Peripherals
- Push Button
- (in symbol LTST-C191KRKT) R

### Library data of the parts
C23 = C0603C104J4REC7867: as C20 on sheet BG_PWR_Radio_Schematic; Supplier 1: Digi-Key; Manufacturer Part Number: C0603C104J4REC7867; RoHS: No; Category: Ceramic Capacitors; Stock 1: 12000; Pricing 1: 1=0.16000, 10=0.11300, 50=0.06420, 100=0.05310, 500=0.03724, 1000=0.03083 (USD)
C24 C25 = C0603X105J4RAC7867: as C18 on sheet BG_PWR_Radio_Schematic; Supplier 1: Digi-Key; Manufacturer Part Number: C0603X105J4RAC7867; RoHS: No; Category: Ceramic Capacitors; Stock 1: 20000; Pricing 1: 1=0.46000, 10=0.32200, 50=0.24340, 100=0.21210, 500=0.15708, 1000=0.13352 (USD); Mount: Surface Mount; Case/Package: 0603; Case Code (Imperial): 0603; Case Code (Metric): 1608; Min Operating Temperature: -55°C; Max Operating Temperature: 125°C; Features: Soft Termination; Packaging: Tape and Reel; Capacitance: 1uF; Tolerance: 5%; Voltage Rating: 16V; ComponentLink1URL: https://api.kemet.com/component-edge/download/datasheet/C0603X105J4RAC7867.pdf?src-supplier=Digi-Key; ComponentLink1Description: https://api.kemet.com/component-edge/download/datasheet/C0603X105J4RAC7867.pdf?src-supplier=Digi-Key
C26 = C3216X6S1C156M160AC: Cap Ceramic 15uF 16V X6S 20% SMD 1206 105°C Punched Paper T/R; Manufacturer: TDK; Supplier 1: Digi-Key; Manufacturer Part Number: C3216X6S1C156M160AC; RoHS: Yes; Category: Ceramic Capacitors; Stock 1: 1775; Pricing 1: 1=0.94000, 10=0.71500, 50=0.59400, 100=0.51150, 500=0.39600, 1000=0.34100 (USD); Mount: Surface Mount; Case/Package: 1206; Case Code (Metric): 3216; Case Code (Imperial): 1206; Weight: 0.000571oz; Dielectric Material: Ceramic; Min Operating Temperature: -55°C; Max Operating Temperature: 105°C; Package Quantity: 2000; Packaging: Tape and Reel; Capacitance: 15uF; Tolerance: 20%; Voltage Rating: 16V; Dielectric: X6S; Termination: SMD/SMT; Voltage Rating (DC): 16V; Series: C; Length: 0.126inch; Width: 0.063inch; Height: 1.6mm; Thickness: 0.071inch; Lead Free: Lead Free; RoHS Compliant: Yes; ComponentLink1URL: https://datasheet.ciiva.com/14893/tdkmlcccaprange-14893189.pdf?src-supplier=Digi-Key; ComponentLink1Description: https://datasheet.ciiva.com/14893/tdkmlcccaprange-14893189.pdf?src-supplier=Digi-Key
C27 C28 = C0603C103J4RACTU: as C16 on sheet BG_PWR_Radio_Schematic; Supplier 1: Digi-Key; Manufacturer Part Number: C0603C103J4RACTU; RoHS: Yes; Category: Ceramic Capacitors; Stock 1: 5301; Pricing 1: 1=0.35000, 10=0.24300, 50=0.16200, 100=0.13760, 500=0.09716, 1000=0.08501 (USD); Mount: Surface Mount; Case/Package: 0603; Case Code (Metric): 1608; Case Code (Imperial): 0603; Dielectric Material: Ceramic; Min Operating Temperature: -55°C; Max Operating Temperature: 125°C; Tolerance: 5%; Capacitance: 10nF; Dielectric: X7R; Packaging: Tape and Reel; Voltage Rating: 16V; Package Quantity: 1; Voltage Rating (DC): 16V; Termination: SMD/SMT; Series: C; Construction: Flat; Length: 1.6mm; Width: 0.031inch; Height: 0.8mm; Thickness: 0.034inch; Lead Pitch: 0.7mm; Depth: 0.8mm; Radiation Hardening: No; REACH SVHC: No SVHC; RoHS Compliant: Yes; ComponentLink1URL: https://datasheet.ciiva.com/5417/kem-c1002-x7r-smd-5417414.pdf?src-supplier=Mouser; ComponentLink1Description: https://datasheet.ciiva.com/5417/kem-c1002-x7r-smd-5417414.pdf?src-supplier=Mouser
D3 = ESDL4151MX4T5G: 15 V Bidirectional Low Capacitance ESD Protection Diode for High Speed Data Lines 15V; Manufacturer: ON Semiconductor; Supplier 1: Digi-Key; Manufacturer Part Number: ESDL4151MX4T5G; RoHS: Yes; Category: ESD and Circuit Protection ICs; Stock 1: 6875; Pricing 1: 1=0.49000, 10=0.36900, 100=0.23000, 500=0.15736, 1000=0.12105, 2000=0.10895 (USD); RoHS Compliant: Yes
H3 = PBC01DAAN: CONN HEADER .100 DUAL STR 2POS; Manufacturer: Sullins; Number of Positions: 2; Gender: Male; Connector Type: Male Pin; Row Spacing: 0.1inch; Supplier 1: Digi-Key; Manufacturer Part Number: PBC01DAAN; RoHS: Yes; Category: Connectors; Stock 1: 12443; Pricing 1: 1=0.20000, 10=0.18500, 25=0.15800, 50=0.13820, 100=0.12830, 250=0.11344, 500=0.10852 (USD); Mount: Through Hole; Color: Black; Contact Plating: Gold; Housing Color: Black; Contact Material: Bronze; Housing Material: Plastic; Packaging: Bulk; Number of Rows: 2; Package Quantity: 1; Termination: Solder; Number of Contacts: 2; Contact Type: Male Pin; Length: 2.54mm; Width: 5.08mm; Height: 2.54mm; Contact Mating Length: 0.23inch; Pitch: 0.1inch; Lead Free: Lead Free; RoHS Compliant: Yes; ComponentLink1URL: http://www.sullinscorp.com/catalogs/77_PAGE108-109_.100_MALE_HDR.pdf?src-supplier=Digi-Key; ComponentLink1Description: http://www.sullinscorp.com/catalogs/77_PAGE108-109_.100_MALE_HDR.pdf?src-supplier=Digi-Key; ComponentLink2URL: http://www.sullinscorp.com/catalogs/97_Page78-79_HEADER_.100_2.54mm_MALE_BREAKAWAY.pdf?src-supplier=Future+Electronics; ComponentLink2Description: http://www.sullinscorp.com/catalogs/97_Page78-79_HEADER_.100_2.54mm_MALE_BREAKAWAY.pdf?src-supplier=Future+Electronics
H4 = PRPC003SAAN-RC: CONN HEADER VERT 3POS 2.54MM; Manufacturer: Sullins; Connector Type: Header, Unshrouded, Breakaway; Number of Positions: 3; Number of Positions Loaded: All; Pitch: 0.100" (2.54mm); Online Catalog: 0.100" (2.54mm) Pitch Connector Headers; Other Names: S9510E-03  S9510E-03-ND; Supplier 1: Digi-Key; Manufacturer Part Number: PRPC003SAAN-RC; Stock 1: 19067; Pricing 1: 1=0.12, 10=0.109, 25=0.0812, 50=0.0696, 100=0.0673, 250=0.058, 500=0.0557 (USD); Standard Package: 1; Category: Connectors, Interconnects; Family: Rectangular Connectors - Headers, Male Pins; Series: -; Packaging: Bulk; Contact Type: Male Pin; Number of Rows: 1; Row Spacing: -; Contact Mating Length: 0.230" (5.84mm); Mounting Type: Through Hole; Termination: Solder; Fastening Type: -; Features: -; Contact Finish: Gold; Contact Finish Thickness: Flash; Color: Black; ComponentLink1URL: https://media.digikey.com/PDF/Data%20Sheets/Sullins%20PDFs/xRxCzzzSxxN-RC_ST_11635-B.pdf?src-supplier=Digi-Key; ComponentLink1Description: https://media.digikey.com/PDF/Data%20Sheets/Sullins%20PDFs/xRxCzzzSxxN-RC_ST_11635-B.pdf?src-supplier=Digi-Key; Supplier Part Number 1: S1011EC-03-ND
IR1 = IR333-A: λP=940nm VF=1.2V View Angle=20; Manufacturer: Everlight; Forward Current: 50mA; Wavelength: 940nm; Forward Voltage: 1.2V; Viewing Angle: 20°; Lens Style: Diffused,Colored,Circular; Number of LEDs: 1; Reverse Voltage: 5V; Power Dissipation: 100mW; Test Current: 20mA; Supplier 1: Digi-Key; Manufacturer Part Number: IR333-A; RoHS: Yes; Category: LEDs; Stock 1: 45297; Pricing 1: 1=0.32000, 10=0.25600, 100=0.11500, 500=0.10388, 1000=0.08533, 2000=0.07420, 5000=0.06678, 10000=0.05936, 25000=0.05565 (USD); Mount: Through Hole; Case/Package: Radial; Number of Pins: 2; Min Operating Temperature: -40°C; Max Operating Temperature: 85°C; Packaging: Bulk; Package Quantity: 500; Orientation: Top View; Number of Elements: 1; Series: -; Max Power Dissipation: 100mW; Length: 5.9mm; Depth: 5.9mm; RoHS Compliant: Yes; Lead Free: Lead Free; ComponentLink1URL: https://datasheet.ciiva.com/2107/201407061516067600-2107736.pdf?src-supplier=Digi-Key; ComponentLink1Description: https://datasheet.ciiva.com/2107/201407061516067600-2107736.pdf?src-supplier=Digi-Key; ComponentLink2URL: https://datasheet.ciiva.com/48438/ir333-a-eng-tds-48438869.pdf?src-supplier=Distrelec; ComponentLink2Description: https://datasheet.ciiva.com/48438/ir333-a-eng-tds-48438869.pdf?src-supplier=Distrelec
LED5 LED6 = LTST-C191KRKT: 0603(H=0.65mm) 红色 λD=631nm VR=5V VF=2.0V~2.4V IF=20mA PD=75mW; Manufacturer: Vishay Lite-On; Lens Color: Colorless; Power Rating: 75mW; Luminous Intensity: 54mcd; Viewing Angle: 130°; Forward Voltage: 2V; Lens Style: Clear,Diffused,Colorless,Rectangular; Forward Current: 30mA; Dominant Wavelength: 631nm; Test Current: 20mA; Lens Transparency: Clear; Number of Elements: 1; Wavelength: 639nm; Reverse Voltage: 5V; Supplier 1: Digi-Key; Manufacturer Part Number: LTST-C191KRKT; RoHS: Yes; Category: LEDs; Stock 1: 9; Pricing 1: 1=0.26000, 10=0.14100, 100=0.06560, 500=0.06060, 1000=0.04747, 2000=0.04646 (USD); Mount: Surface Mount; Case/Package: 0603; Number of Pins: 2; Color: Red; Case Code (Metric): 1608; Case Code (Imperial): 0603; Min Operating Temperature: -55°C; Max Operating Temperature: 85°C; Packaging: Tape and Reel; Package Quantity: 1; Illumination Color: Red; Power Dissipation: 75mW; Number of LEDs: 1; Voltage: 2V; Length: 1.6mm; Width: 0.8mm; Height: 0.55mm; Depth: 0.8mm; Radiation Hardening: No; Lead Free: Lead Free; RoHS Compliant: Yes; ComponentLink1URL: https://datasheet.ciiva.com/11773/0900766b80dc02b2-11773601.pdf?src-supplier=RSComponents; ComponentLink1Description: https://datasheet.ciiva.com/11773/0900766b80dc02b2-11773601.pdf?src-supplier=RSComponents; ComponentLink2URL: https://datasheet.ciiva.com/12400/lite-on-ltst-c191krkt-190135-12400910.pdf?src-supplier=Mouser; ComponentLink2Description: https://datasheet.ciiva.com/12400/lite-on-ltst-c191krkt-190135-12400910.pdf?src-supplier=Mouser; ComponentLink3URL: https://datasheet.ciiva.com/16212/ltst-c191krkt-16212419.pdf?src-supplier=Future+Electronics; ComponentLink3Description: https://datasheet.ciiva.com/16212/ltst-c191krkt-16212419.pdf?src-supplier=Future+Electronics; ComponentLink4URL: https://datasheet.ciiva.com/15117/getdatasheetpartid-141922-15117737.pdf?src-supplier=Verical; ComponentLink4Description: https://datasheet.ciiva.com/15117/getdatasheetpartid-141922-15117737.pdf?src-supplier=Verical; ComponentLink5URL: https://datasheet.ciiva.com/2109/s-110-ltst-c191krkt-2109971.pdf?src-supplier=Digi-Key; ComponentLink5Description: https://datasheet.ciiva.com/2109/s-110-ltst-c191krkt-2109971.pdf?src-supplier=Digi-Key; ComponentLink6URL: https://datasheet.ciiva.com/2109/s-110-ltst-c191krkt-2109970.pdf?src-supplier=Digi-Key; ComponentLink6Description: https://datasheet.ciiva.com/2109/s-110-ltst-c191krkt-2109970.pdf?src-supplier=Digi-Key; ComponentLink7URL: https://datasheet.ciiva.com/2109/s-110-ltst-c191krkt-2109972.pdf?src-supplier=Digi-Key; ComponentLink7Description: https://datasheet.ciiva.com/2109/s-110-ltst-c191krkt-2109972.pdf?src-supplier=Digi-Key
R16 = RMCF0603FT30R0: Res Thick Film 0603 30 Ohm 1% 1/10W ±100ppm/°C Molded SMD SMD Paper T/R; Manufacturer: Stackpole Electronics; Resistance: 30R; Max Power Dissipation: 100mW; Supplier 1: Digi-Key; Manufacturer Part Number: RMCF0603FT30R0; RoHS: Yes; Category: Chip SMD Resistors; Stock 1: 3655; Pricing 1: 1=0.10000, 10=0.01700, 100=0.00680, 1000=0.00305, 2500=0.00264 (USD); Mount: Surface Mount; Case/Package: 0603; Case Code (Metric): 1608; Case Code (Imperial): 0603; Contact Plating: Tin,Matte; Min Operating Temperature: -55°C; Max Operating Temperature: 155°C; Package Quantity: 5000; Packaging: Tape and Reel; Tolerance: 1%; Resistor Type: Thick Film; Number of Terminations: 2; Temperature Coefficient: 100ppm/°C; Features: Automotive AEC-Q200; Series: RMCF; Length: 0.061inch; Width: 0.031inch; Height: 0.022inch; Radiation Hardening: No; Lead Free: Contains Lead; RoHS Compliant: Yes; ComponentLink1URL: https://www.seielect.com/catalog/SEI-RMCF_RMCP.pdf?src-supplier=Avnet; ComponentLink1Description: https://www.seielect.com/catalog/SEI-RMCF_RMCP.pdf?src-supplier=Avnet; ComponentLink2URL: https://www.seielect.com/catalog/sei-rmcf_rmcp.pdf?src-supplier=Digi-Key; ComponentLink2Description: https://www.seielect.com/catalog/sei-rmcf_rmcp.pdf?src-supplier=Digi-Key; ComponentLink3URL: https://www.seielect.com/catalog/SEI-Packaging.pdf?src-supplier=Digi-Key; ComponentLink3Description: https://www.seielect.com/catalog/SEI-Packaging.pdf?src-supplier=Digi-Key
R17 = CRCW06032K00FKTA: Res Thick Film 0603 2K Ohm 1% 1/10W ±100ppm/°C Molded SMD SMD Paper T/R; Manufacturer: Vishay Dale; Resistance: 2kR; Power Rating: 100mW; Voltage Rating: 75V; Supplier 1: Digi-Key; Manufacturer Part Number: CRCW06032K00FKTA; RoHS: No; Category: Chip SMD Resistors; Stock 1: 4209; Pricing 1: 1=0.16000, 10=0.13900, 100=0.05350, 1000=0.02353, 2500=0.02032 (USD); Mount: Surface Mount; Case/Package: 0603; Number of Pins: 2; Weight: 7.1E-05oz; Case Code (Imperial): 0603; Case Code (Metric): 1608; Contact Plating: Tin,Lead; Min Operating Temperature: -55°C; Max Operating Temperature: 155°C; Tolerance: 1%; Packaging: Tape and Reel; Package Quantity: 5000; Resistor Type: Thick Film; Number of Terminations: 2; Termination: SMD/SMT; Temperature Coefficient: 100ppm/°C; Max Power Dissipation: 100mW; Power Dissipation: 100mW; Voltage Rating (DC): 75V; Features: Automotive AEC-Q200; Series: CRCW; Construction: Rectangular; Resistance Tolerance: 1%; Length: 1.55mm; Width: 0.033inch; Height: 0.02inch; Depth: 0.85mm; Radiation Hardening: No; Lead Free: Contains Lead; RoHS Compliant: No; REACH SVHC: Unknown; Military Standard: Not; ComponentLink1URL: https://datasheet.ciiva.com/15159/getdatasheetpartid-28881-15159221.pdf?src-supplier=Verical; ComponentLink1Description: https://datasheet.ciiva.com/15159/getdatasheetpartid-28881-15159221.pdf?src-supplier=Verical; ComponentLink2URL: https://datasheet.ciiva.com/9093/dcrcw-9093590.pdf?src-supplier=Avnet; ComponentLink2Description: https://datasheet.ciiva.com/9093/dcrcw-9093590.pdf?src-supplier=Avnet; ComponentLink3URL: https://datasheet.ciiva.com/2565/dcrcw-2565199.pdf?src-supplier=Digi-Key; ComponentLink3Description: https://datasheet.ciiva.com/2565/dcrcw-2565199.pdf?src-supplier=Digi-Key; ComponentLink4URL: https://datasheet.ciiva.com/9094/dcrcw-9094813.pdf?src-supplier=Avnet; ComponentLink4Description: https://datasheet.ciiva.com/9094/dcrcw-9094813.pdf?src-supplier=Avnet
R18 R19 = RMCF0603FT1K00: Res Thick Film 0603 1K Ohm 1% 0.1W(1/10W) ±100ppm/C Pad SMD Automotive T/R; Manufacturer: Stackpole Electronics; Resistance: 1kR; Power Rating: 100mW; Temperature Coefficient: 100ppm/°C; Supplier 1: Digi-Key; Manufacturer Part Number: RMCF0603FT1K00; RoHS: Yes; Category: Chip SMD Resistors; Pricing 1: 1=0.10000, 10=0.01700, 100=0.00680, 1000=0.00305, 2500=0.00264 (USD); Mount: Surface Mount; Case/Package: 0603; Case Code (Metric): 1608; Case Code (Imperial): 0603; Contact Plating: Tin,Matte; Size Code: 0603; Min Operating Temperature: -55°C; Max Operating Temperature: 155°C; Tolerance: 1%; Packaging: Tape and Reel; Resistor Type: Thick Film; Number of Terminations: 2; Max Power Dissipation: 100mW; Features: Automotive AEC-Q200; Series: RMCF; Construction: Rectangular; Length: 1.55mm; Width: 0.031inch; Height: 0.022inch; Depth: 0.8mm; Radiation Hardening: No; Military Standard: Not; Lead Free: Lead Free; RoHS Compliant: Yes; ComponentLink1URL: https://www.seielect.com/catalog/sei-rmcf_rmcp.pdf?src-supplier=Digi-Key; ComponentLink1Description: https://www.seielect.com/catalog/sei-rmcf_rmcp.pdf?src-supplier=Digi-Key; ComponentLink2URL: https://www.seielect.com/catalog/SEI-RMCF_RMCP.pdf?src-supplier=Avnet; ComponentLink2Description: https://www.seielect.com/catalog/SEI-RMCF_RMCP.pdf?src-supplier=Avnet; ComponentLink3URL: https://www.seielect.com/catalog/SEI-Packaging.pdf?src-supplier=Avnet; ComponentLink3Description: https://www.seielect.com/catalog/SEI-Packaging.pdf?src-supplier=Avnet; ComponentLink4URL: https://www.seielect.com/catalog/SEI-Packaging.pdf?src-supplier=Arrow+Electronics; ComponentLink4Description: https://www.seielect.com/catalog/SEI-Packaging.pdf?src-supplier=Arrow+Electronics; ComponentLink5URL: https://www.seielect.com/catalog/SEI-RMCF_RMCP.pdf?src-supplier=Avnet+Asia; ComponentLink5Description: https://www.seielect.com/catalog/SEI-RMCF_RMCP.pdf?src-supplier=Avnet+Asia; ComponentLink6URL: http://www.seielect.com/Catalog/SEI-rmc.pdf?src-supplier=Future+Electronics; ComponentLink6Description: http://www.seielect.com/Catalog/SEI-rmc.pdf?src-supplier=Future+Electronics; ComponentLink7URL: https://www.seielect.com/catalog/SEI-Packaging.pdf?src-supplier=Verical; ComponentLink7Description: https://www.seielect.com/catalog/SEI-Packaging.pdf?src-supplier=Verical; ComponentLink8URL: https://www.seielect.com/catalog/SEI-Packaging.pdf?src-supplier=Quest; ComponentLink8Description: https://www.seielect.com/catalog/SEI-Packaging.pdf?src-supplier=Quest
R20 R21 = CRCW060347R0FKEAC: Res Thick Film 0603 47 Ohm 1% 1/10W ±100ppm/°C Molded SMD Paper T/R; Manufacturer: Vishay Semiconductors; Resistance: 47R; Power Rating: 100mW; Supplier 1: Digi-Key; Manufacturer Part Number: CRCW060347R0FKEAC; RoHS: Yes; Category: Chip SMD Resistors; Stock 1: 3057; Pricing 1: 1=0.10000, 10=0.03600, 100=0.01450, 1000=0.00652, 2500=0.00566 (USD); Mount: Surface Mount; Case/Package: Molded; Contact Plating: Tin; Min Operating Temperature: -55°C; Max Operating Temperature: 155°C; Resistor Type: Thick Film; Termination: Wraparound; Tolerance: 1%; Temperature Coefficient: 100ppm/°C; Length: 1.55mm; Lead Free: Lead Free; RoHS Compliant: Yes; ComponentLink1URL: http://www.vishay.com/docs/28773/crcwce3.pdf?src-supplier=Digi-Key; ComponentLink1Description: http://www.vishay.com/docs/28773/crcwce3.pdf?src-supplier=Digi-Key; ComponentLink2URL: http://www.vishay.com/docs/20035/dcrcwe3.pdf?src-supplier=Avnet+Asia; ComponentLink2Description: http://www.vishay.com/docs/20035/dcrcwe3.pdf?src-supplier=Avnet+Asia
SW7 SW8 = TL3305AF160QG: TL3305A Series SPST 12 V 4.5 x 4.5 mm 160 gf Top Actuated SMT Tactile Switch; Manufacturer: E-Switch; Mechanical Life: 500000Cycles; Illumination Type: Non-Illuminated; Operating Force: 160gf; Switch Travel: 0.2mm; Switch Function: Off-Mom; Actuator Type: Standard; Supplier 1: Digi-Key; Manufacturer Part Number: TL3305AF160QG; RoHS: Yes; Category: Tactile Switches; Stock 1: 727; Pricing 1: 1=0.21000, 10=0.20500, 25=0.19440, 100=0.17600, 250=0.16048, 500=0.14918, 1000=0.12726 (USD); Mount: Surface Mount; Min Operating Temperature: -20°C; Max Operating Temperature: 70°C; Packaging: Tape and Reel; Termination: Gull Wing; Throw Configuration: SPST; Lead Free: Lead Free; RoHS Compliant: Yes; ComponentLink1URL: http://www.farnell.com/datasheets/2554191.pdf?src-supplier=Farnell; ComponentLink1Description: http://www.farnell.com/datasheets/2554191.pdf?src-supplier=Farnell; ComponentLink2URL: http://spec_sheets.e-switch.com/specs/P010468.pdf?src-supplier=Digi-Key; ComponentLink2Description: http://spec_sheets.e-switch.com/specs/P010468.pdf?src-supplier=Digi-Key; ComponentLink3URL: http://www.farnell.com/datasheets/2554191.pdf?src-supplier=Newark; ComponentLink3Description: http://www.farnell.com/datasheets/2554191.pdf?src-supplier=Newark
TP4 TP5 = TP_10x_Probe: Test Point 300 mil centers
U5 = ADP196ACPZN-R7: ICHIGH-SIDELOADSWITCH6LFCSP; Manufacturer: Analog Devices; Number of Outputs: 1; Output Current: 5A; On-State Resistance: 36mR; Turn-On Delay Time: 2ms; Max Supply Current: 4A; Interface: On/Off; Max Output Current: 3A; Operating Supply Current: 250nA; Max Input Voltage: 5.5V; Min Input Voltage: 1.8V; Fault Protection: Over Temperature; Output Configuration: High Side; Supplier 1: Digi-Key; Manufacturer Part Number: ADP196ACPZN-R7; RoHS: Yes; Category: Power Management ICs; Pricing 1: 1=1.72000, 10=1.54500, 25=1.45760, 100=1.24180, 250=1.16600, 500=1.02024, 1000=0.90750 (USD); Mount: Surface Mount; Case/Package: LFCSP EP; Number of Pins: 6; Min Operating Temperature: -40°C; Max Operating Temperature: 85°C; Packaging: Tape and Reel; Package Quantity: 3000; Operating Supply Voltage: 5.5V; Series: -; Radiation Hardening: No; Lead Free: Contains Lead; ComponentLink1URL: http://www.mouser.com/ds/2/609/ADP196-878889.pdf?src-supplier=Mouser; ComponentLink1Description: http://www.mouser.com/ds/2/609/ADP196-878889.pdf?src-supplier=Mouser; ComponentLink2URL: http://components.arrow.com/part/dataview/58949242S513746N2771?src-supplier=Arrow+Electronics; ComponentLink2Description: http://components.arrow.com/part/dataview/58949242S513746N2771?src-supplier=Arrow+Electronics; ComponentLink3URL: http://components.arrow.com/part/dataview/1762_07011809?src-supplier=Arrow+Europe; ComponentLink3Description: http://components.arrow.com/part/dataview/1762_07011809?src-supplier=Arrow+Europe; ComponentLink4URL: http://www.analog.com/static/imported-files/data_sheets/ADP196.pdf?src-supplier=Avnet; ComponentLink4Description: http://www.analog.com/static/imported-files/data_sheets/ADP196.pdf?src-supplier=Avnet; ComponentLink5URL: http://www.analog.com/media/en/technical-documentation/data-sheets/ADP196.pdf?src-supplier=Digi-Key; ComponentLink5Description: http://www.analog.com/media/en/technical-documentation/data-sheets/ADP196.pdf?src-supplier=Digi-Key; ComponentLink6URL: https://www.analog.com/media/en/technical-documentation/data-sheets/ADP196.pdf?src-supplier=Digi-Key; ComponentLink6Description: https://www.analog.com/media/en/technical-documentation/data-sheets/ADP196.pdf?src-supplier=Digi-Key
U6 = SI1141-A11-GMR: Proximity and Ambient Light Sensor Digital Output 1.8V/2.5V/3.3V Automotive 10-Pin QFN T/R; Manufacturer: Silicon Labs; Operating Supply Voltage: 1.8V; Min Supply Voltage: 1.71V; Max Supply Voltage: 3.6V; Sensing Distance: 500mm; Output Type: I2C; Sensing Method: Optical; Output Configuration: Analog; Supplier 1: Digi-Key; Manufacturer Part Number: SI1141-A11-GMR; RoHS: Yes; Category: Optical Sensors; Stock 1: 9895; Pricing 1: 1=7.03000, 5=6.20400, 10=5.48000, 25=4.44640, 50=3.92920, 100=3.82580, 500=3.20540, 1000=2.99860 (USD); Case/Package: QFN; Number of Pins: 10; Min Operating Temperature: -40°C; Max Operating Temperature: 85°C; Package Quantity: 1; Packaging: Tape and Reel; Series: -; Radiation Hardening: No; REACH SVHC: Unknown; RoHS Compliant: Yes; ComponentLink1URL: https://datasheet.ciiva.com/8113/+si114x-8113760.pdf?src-supplier=Avnet; ComponentLink1Description: https://datasheet.ciiva.com/8113/+si114x-8113760.pdf?src-supplier=Avnet; ComponentLink2URL: https://datasheet.ciiva.com/12088/si114x-41368-12088691.pdf?src-supplier=Mouser; ComponentLink2Description: https://datasheet.ciiva.com/12088/si114x-41368-12088691.pdf?src-supplier=Mouser; ComponentLink3URL: https://datasheet.ciiva.com/2819/si114x-2819368.pdf?src-supplier=Digi-Key; ComponentLink3Description: https://datasheet.ciiva.com/2819/si114x-2819368.pdf?src-supplier=Digi-Key; ComponentLink4URL: https://datasheet.ciiva.com/2819/si114x-2819369.pdf?src-supplier=Digi-Key; ComponentLink4Description: https://datasheet.ciiva.com/2819/si114x-2819369.pdf?src-supplier=Digi-Key; ComponentLink5URL: https://datasheet.ciiva.com/2819/si114x-2819370.pdf?src-supplier=Digi-Key; ComponentLink5Description: https://datasheet.ciiva.com/2819/si114x-2819370.pdf?src-supplier=Digi-Key; ComponentLink6URL: https://datasheet.ciiva.com/26808/getdatasheetpartid-567972-26808183.pdf?src-supplier=Verical; ComponentLink6Description: https://datasheet.ciiva.com/26808/getdatasheetpartid-567972-26808183.pdf?src-supplier=Verical